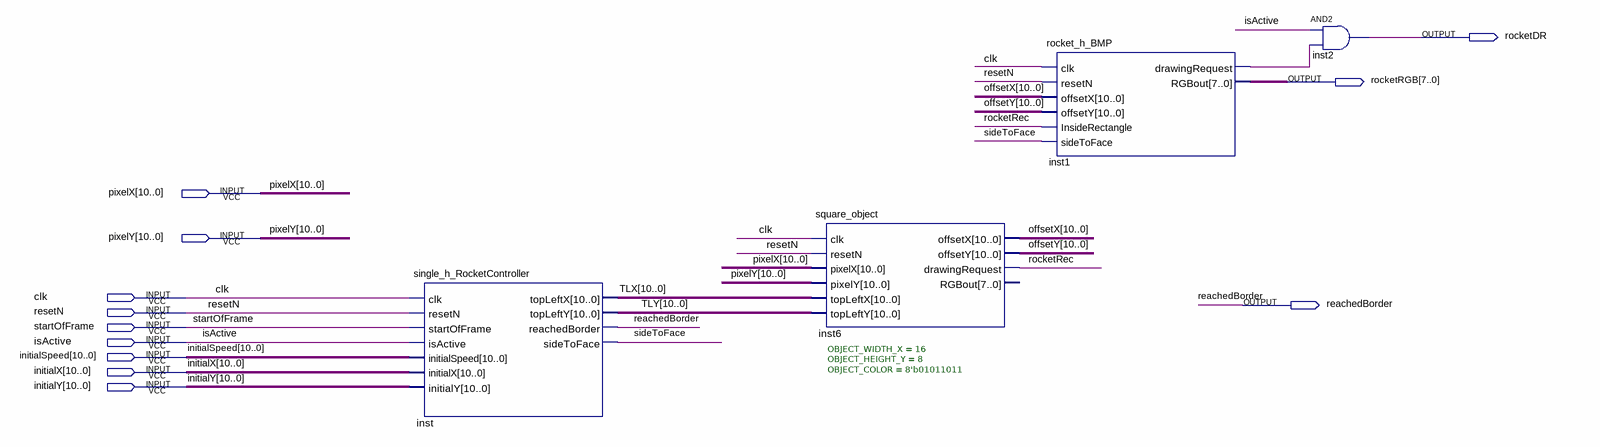
[diagram p0: schematic sheet]
// Quartus schematic h_singleRocket.bdf as structural Verilog: 4 symbols, 12 pins
module h_singleRocket (
  input  [10:0] pixelX,
  input  [10:0] pixelY,
  input  clk,
  input  resetN,
  input  startOfFrame,
  input  isActive,
  input  [10:0] initialSpeed,
  input  [10:0] initialX,
  input  [10:0] initialY,
  output rocketDR,
  output [7:0] rocketRGB,
  output reachedBorder
);

  wire inst1_drawingrequest, rocketRec, sideToFace;
  wire [10:0] offsetX, offsetY, TLX, TLY;

  single_h_RocketController inst (
    .clk(clk), .resetN(resetN), .startOfFrame(startOfFrame), .isActive(isActive),
    .initialSpeed(initialSpeed), .initialX(initialX), .initialY(initialY), .topLeftX(TLX), .topLeftY(TLY),
    .reachedBorder(reachedBorder), .sideToFace(sideToFace));
  square_object #(.OBJECT_WIDTH_X(16), .OBJECT_HEIGHT_Y(8), .OBJECT_COLOR(8'b01011011)) inst6 (
    .clk(clk), .resetN(resetN), .pixelX(pixelX), .pixelY(pixelY), .topLeftX(TLX), .topLeftY(TLY),
    .offsetX(offsetX), .offsetY(offsetY), .drawingRequest(rocketRec));  // open: RGBout
  rocket_h_BMP inst1 (
    .clk(clk), .resetN(resetN), .offsetX(offsetX), .offsetY(offsetY), .InsideRectangle(rocketRec),
    .sideToFace(sideToFace), .drawingRequest(inst1_drawingrequest), .RGBout(rocketRGB));
  and inst2 (rocketDR, isActive, inst1_drawingrequest);
endmodule
